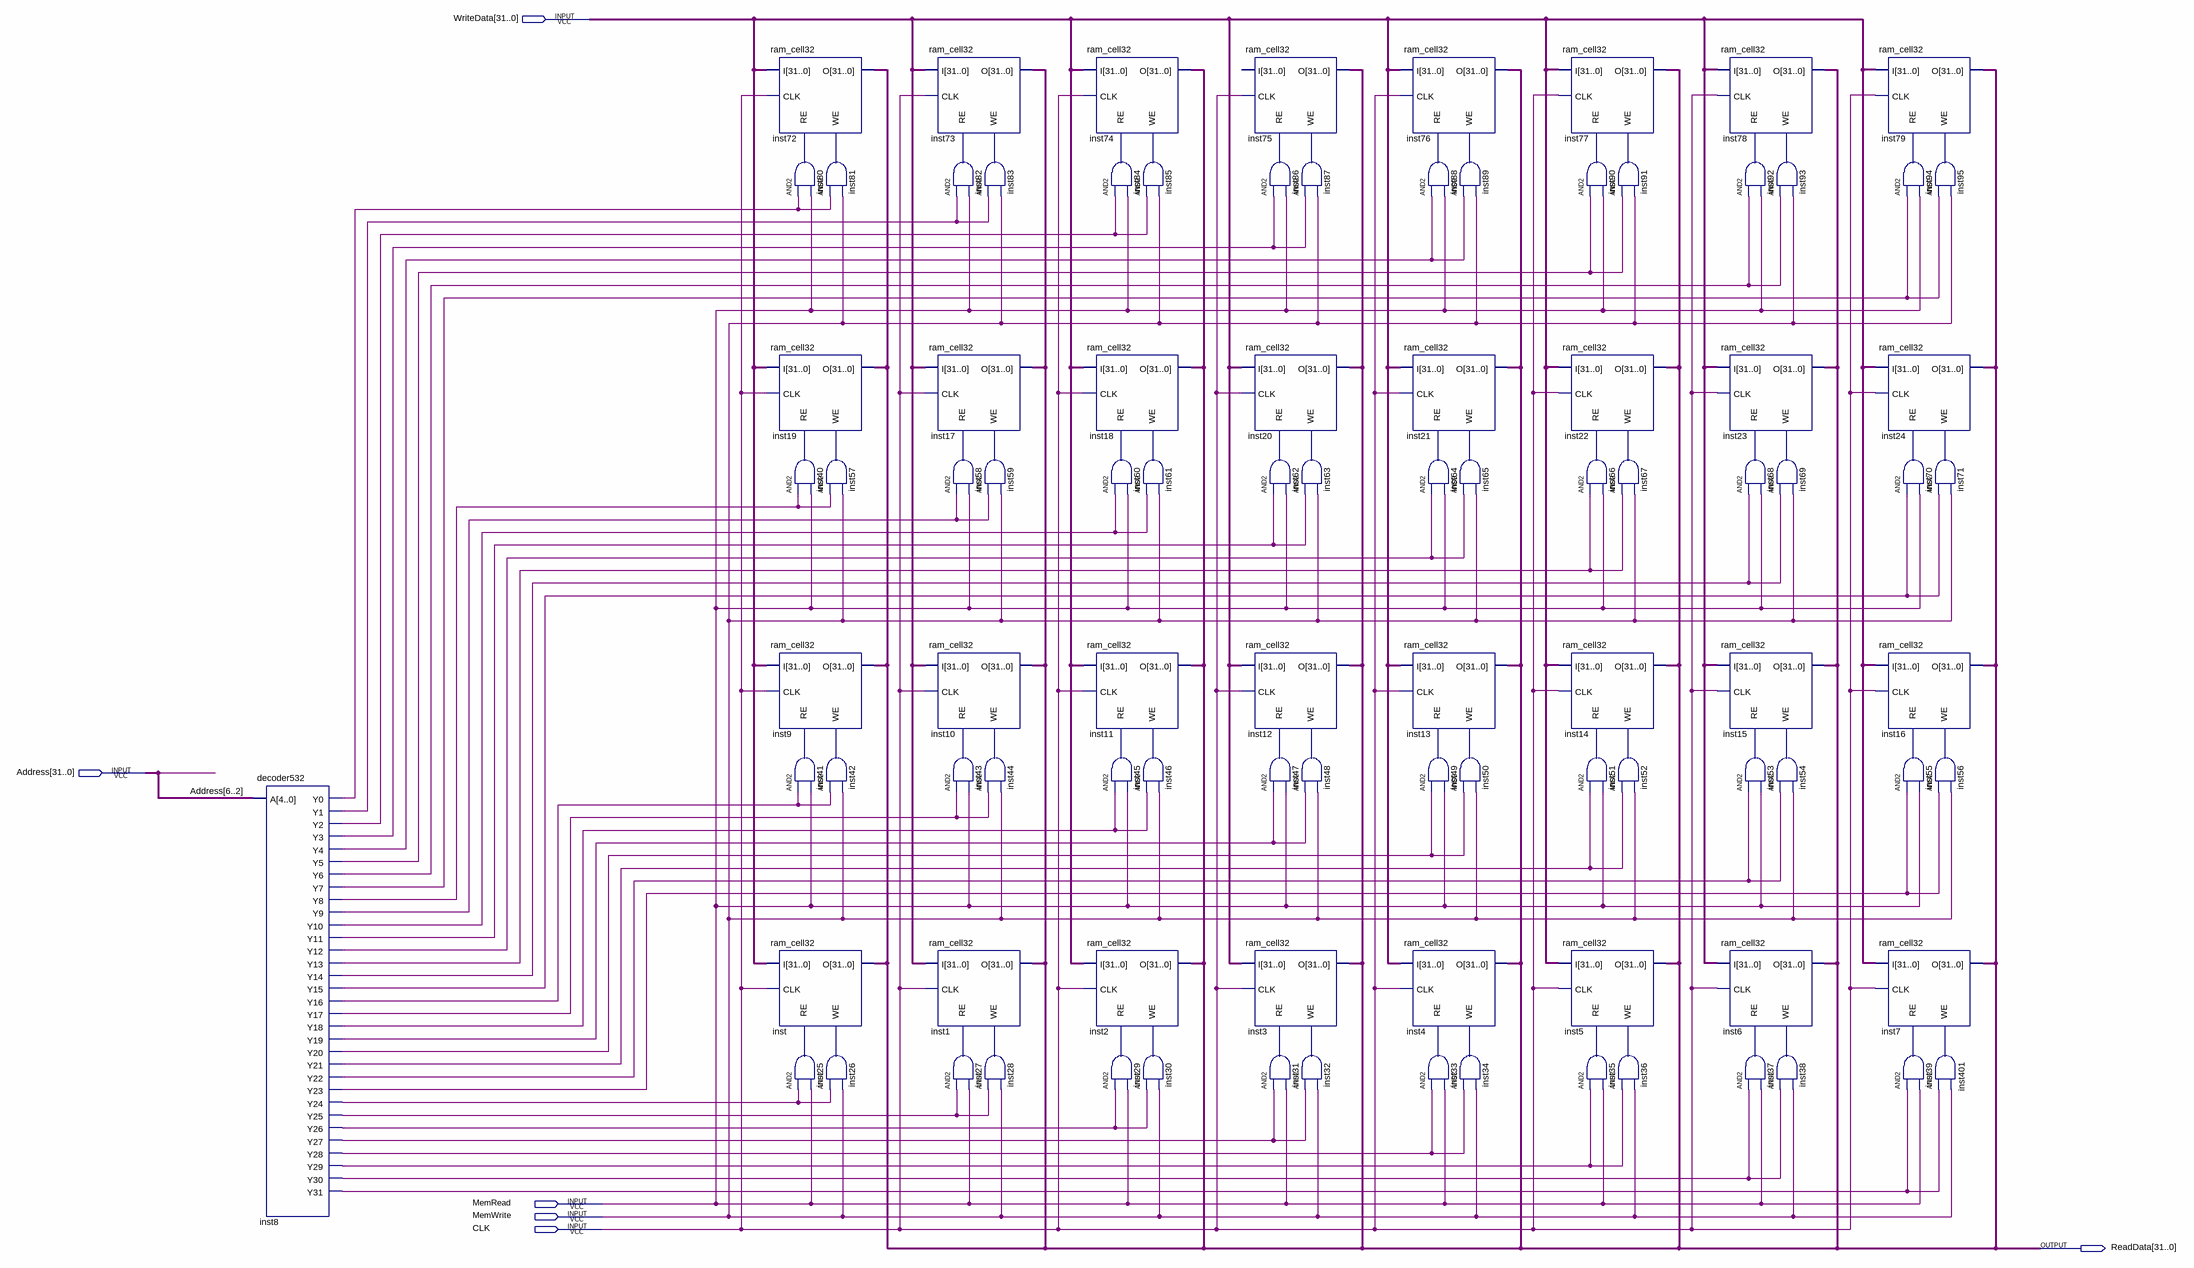
[diagram p0: schematic sheet]
// Quartus schematic DataMemory.bdf as structural Verilog: 97 symbols, 6 pins
module DataMemory (
  input  [31:0] WriteData,
  input  [31:0] Address,
  input  MemRead,
  input  MemWrite,
  input  CLK,
  output [31:0] ReadData
);

  wire inst8_y0, inst8_y1, inst8_y2, inst8_y3, inst8_y4, inst8_y5, inst8_y6, inst8_y7, inst8_y8, inst8_y9,
       inst8_y10, inst8_y11, inst8_y12, inst8_y13, inst8_y14, inst8_y15, inst8_y16, inst8_y17, inst8_y18,
       inst8_y19, inst8_y20, inst8_y21, inst8_y22, inst8_y23, inst8_y24, inst8_y25, inst8_y26, inst8_y27,
       inst8_y28, inst8_y29, inst8_y30, inst8_y31, inst25_out, inst26_out, inst27_out, inst28_out,
       inst29_out, inst30_out, inst31_out, inst32_out, inst33_out, inst34_out, inst35_out, inst36_out,
       inst37_out, inst38_out, inst39_out, inst40_out, inst41_out, inst42_out, inst43_out, inst44_out,
       inst45_out, inst46_out, inst47_out, inst48_out, inst49_out, inst50_out, inst51_out, inst52_out,
       inst53_out, inst54_out, inst55_out, inst56_out, inst57_out, inst58_out, inst59_out, inst60_out,
       inst61_out, inst62_out, inst63_out, inst64_out, inst65_out, inst66_out, inst67_out, inst68_out,
       inst69_out, inst70_out, inst71_out, inst80_out, inst81_out, inst82_out, inst83_out, inst84_out,
       inst85_out, inst86_out, inst87_out, inst88_out, inst89_out, inst90_out, inst91_out, inst92_out,
       inst93_out, inst94_out, inst95_out, inst401_out;

  decoder532 inst8 (
    .A(Address[6:2]), .Y0(inst8_y0), .Y1(inst8_y1), .Y2(inst8_y2), .Y3(inst8_y3), .Y4(inst8_y4),
    .Y5(inst8_y5), .Y6(inst8_y6), .Y7(inst8_y7), .Y8(inst8_y8), .Y9(inst8_y9), .Y10(inst8_y10),
    .Y11(inst8_y11), .Y12(inst8_y12), .Y13(inst8_y13), .Y14(inst8_y14), .Y15(inst8_y15), .Y16(inst8_y16),
    .Y17(inst8_y17), .Y18(inst8_y18), .Y19(inst8_y19), .Y20(inst8_y20), .Y21(inst8_y21), .Y22(inst8_y22),
    .Y23(inst8_y23), .Y24(inst8_y24), .Y25(inst8_y25), .Y26(inst8_y26), .Y27(inst8_y27), .Y28(inst8_y28),
    .Y29(inst8_y29), .Y30(inst8_y30), .Y31(inst8_y31));
  ram_cell32 inst72 (.I(WriteData), .CLK(CLK), .RE(inst80_out), .WE(inst81_out), .O(ReadData));
  ram_cell32 inst19 (.I(WriteData), .CLK(CLK), .RE(inst40_out), .WE(inst57_out), .O(ReadData));
  ram_cell32 inst9 (.I(WriteData), .CLK(CLK), .RE(inst41_out), .WE(inst42_out), .O(ReadData));
  ram_cell32 inst (.I(WriteData), .CLK(CLK), .RE(inst25_out), .WE(inst26_out), .O(ReadData));
  and inst80 (inst80_out, inst8_y0, MemRead);
  and inst81 (inst81_out, inst8_y0, MemWrite);
  and inst40 (inst40_out, inst8_y8, MemRead);
  and inst57 (inst57_out, inst8_y8, MemWrite);
  and inst41 (inst41_out, inst8_y16, MemRead);
  and inst42 (inst42_out, inst8_y16, MemWrite);
  and inst25 (inst25_out, inst8_y24, MemRead);
  and inst26 (inst26_out, inst8_y24, MemWrite);
  ram_cell32 inst73 (.I(WriteData), .CLK(CLK), .RE(inst82_out), .WE(inst83_out), .O(ReadData));
  and inst82 (inst82_out, inst8_y1, MemRead);
  ram_cell32 inst17 (.I(WriteData), .CLK(CLK), .RE(inst58_out), .WE(inst59_out), .O(ReadData));
  and inst58 (inst58_out, inst8_y9, MemRead);
  ram_cell32 inst10 (.I(WriteData), .CLK(CLK), .RE(inst43_out), .WE(inst44_out), .O(ReadData));
  and inst43 (inst43_out, inst8_y17, MemRead);
  ram_cell32 inst1 (.I(WriteData), .CLK(CLK), .RE(inst27_out), .WE(inst28_out), .O(ReadData));
  and inst27 (inst27_out, inst8_y25, MemRead);
  and inst83 (inst83_out, inst8_y1, MemWrite);
  and inst59 (inst59_out, inst8_y9, MemWrite);
  and inst44 (inst44_out, inst8_y17, MemWrite);
  and inst28 (inst28_out, inst8_y25, MemWrite);
  ram_cell32 inst74 (.I(WriteData), .CLK(CLK), .RE(inst84_out), .WE(inst85_out), .O(ReadData));
  and inst84 (inst84_out, inst8_y2, MemRead);
  ram_cell32 inst18 (.I(WriteData), .CLK(CLK), .RE(inst60_out), .WE(inst61_out), .O(ReadData));
  and inst60 (inst60_out, inst8_y10, MemRead);
  ram_cell32 inst11 (.I(WriteData), .CLK(CLK), .RE(inst45_out), .WE(inst46_out), .O(ReadData));
  and inst45 (inst45_out, inst8_y18, MemRead);
  ram_cell32 inst2 (.I(WriteData), .CLK(CLK), .RE(inst29_out), .WE(inst30_out), .O(ReadData));
  and inst29 (inst29_out, inst8_y26, MemRead);
  and inst85 (inst85_out, inst8_y2, MemWrite);
  and inst61 (inst61_out, inst8_y10, MemWrite);
  and inst46 (inst46_out, inst8_y18, MemWrite);
  and inst30 (inst30_out, inst8_y26, MemWrite);
  ram_cell32 inst75 (.CLK(CLK), .RE(inst86_out), .WE(inst87_out), .O(ReadData));  // open: I
  and inst86 (inst86_out, inst8_y3, MemRead);
  ram_cell32 inst20 (.I(WriteData), .CLK(CLK), .RE(inst62_out), .WE(inst63_out), .O(ReadData));
  and inst62 (inst62_out, inst8_y11, MemRead);
  ram_cell32 inst12 (.I(WriteData), .CLK(CLK), .RE(inst47_out), .WE(inst48_out), .O(ReadData));
  and inst47 (inst47_out, inst8_y19, MemRead);
  ram_cell32 inst3 (.I(WriteData), .CLK(CLK), .RE(inst31_out), .WE(inst32_out), .O(ReadData));
  and inst31 (inst31_out, inst8_y27, MemRead);
  and inst87 (inst87_out, inst8_y3, MemWrite);
  and inst63 (inst63_out, inst8_y11, MemWrite);
  and inst48 (inst48_out, inst8_y19, MemWrite);
  and inst32 (inst32_out, inst8_y27, MemWrite);
  ram_cell32 inst76 (.I(WriteData), .CLK(CLK), .RE(inst88_out), .WE(inst89_out), .O(ReadData));
  and inst88 (inst88_out, inst8_y4, MemRead);
  ram_cell32 inst21 (.I(WriteData), .CLK(CLK), .RE(inst64_out), .WE(inst65_out), .O(ReadData));
  and inst64 (inst64_out, inst8_y12, MemRead);
  ram_cell32 inst13 (.I(WriteData), .CLK(CLK), .RE(inst49_out), .WE(inst50_out), .O(ReadData));
  and inst49 (inst49_out, inst8_y20, MemRead);
  ram_cell32 inst4 (.I(WriteData), .CLK(CLK), .RE(inst33_out), .WE(inst34_out), .O(ReadData));
  and inst33 (inst33_out, inst8_y28, MemRead);
  and inst89 (inst89_out, inst8_y4, MemWrite);
  and inst65 (inst65_out, inst8_y12, MemWrite);
  and inst50 (inst50_out, inst8_y20, MemWrite);
  and inst34 (inst34_out, inst8_y28, MemWrite);
  ram_cell32 inst77 (.I(WriteData), .CLK(CLK), .RE(inst90_out), .WE(inst91_out), .O(ReadData));
  and inst90 (inst90_out, inst8_y5, MemRead);
  ram_cell32 inst22 (.I(WriteData), .CLK(CLK), .RE(inst66_out), .WE(inst67_out), .O(ReadData));
  and inst66 (inst66_out, inst8_y13, MemRead);
  ram_cell32 inst14 (.I(WriteData), .CLK(CLK), .RE(inst51_out), .WE(inst52_out), .O(ReadData));
  and inst51 (inst51_out, inst8_y21, MemRead);
  ram_cell32 inst5 (.I(WriteData), .CLK(CLK), .RE(inst35_out), .WE(inst36_out), .O(ReadData));
  and inst35 (inst35_out, inst8_y29, MemRead);
  and inst91 (inst91_out, inst8_y5, MemWrite);
  and inst67 (inst67_out, inst8_y13, MemWrite);
  and inst52 (inst52_out, inst8_y21, MemWrite);
  and inst36 (inst36_out, inst8_y29, MemWrite);
  ram_cell32 inst78 (.I(WriteData), .CLK(CLK), .RE(inst92_out), .WE(inst93_out), .O(ReadData));
  ram_cell32 inst23 (.I(WriteData), .CLK(CLK), .RE(inst68_out), .WE(inst69_out), .O(ReadData));
  ram_cell32 inst15 (.I(WriteData), .CLK(CLK), .RE(inst53_out), .WE(inst54_out), .O(ReadData));
  ram_cell32 inst6 (.I(WriteData), .CLK(CLK), .RE(inst37_out), .WE(inst38_out), .O(ReadData));
  and inst92 (inst92_out, inst8_y6, MemRead);
  and inst93 (inst93_out, inst8_y6, MemWrite);
  and inst68 (inst68_out, inst8_y14, MemRead);
  and inst69 (inst69_out, inst8_y14, MemWrite);
  and inst53 (inst53_out, inst8_y22, MemRead);
  and inst54 (inst54_out, inst8_y22, MemWrite);
  and inst37 (inst37_out, inst8_y30, MemRead);
  and inst38 (inst38_out, inst8_y30, MemWrite);
  ram_cell32 inst79 (.I(WriteData), .CLK(CLK), .RE(inst94_out), .WE(inst95_out), .O(ReadData));
  ram_cell32 inst24 (.I(WriteData), .CLK(CLK), .RE(inst70_out), .WE(inst71_out), .O(ReadData));
  ram_cell32 inst16 (.I(WriteData), .CLK(CLK), .RE(inst55_out), .WE(inst56_out), .O(ReadData));
  ram_cell32 inst7 (.I(WriteData), .CLK(CLK), .RE(inst39_out), .WE(inst401_out), .O(ReadData));
  and inst94 (inst94_out, inst8_y7, MemRead);
  and inst95 (inst95_out, inst8_y7, MemWrite);
  and inst70 (inst70_out, inst8_y15, MemRead);
  and inst71 (inst71_out, inst8_y15, MemWrite);
  and inst55 (inst55_out, inst8_y23, MemRead);
  and inst56 (inst56_out, inst8_y23, MemWrite);
  and inst39 (inst39_out, inst8_y31, MemRead);
  and inst401 (inst401_out, inst8_y31, MemWrite);
endmodule
